# Altium schematic sheet Almazny_top.SchDoc: Almazny
size 420 x 297 mm; Author: many authors; CompanyName: WUT; DrawnBy: S. Hanasz; Organization: WUT ISE; Address1: Warsaw Univeristy of Technology; Address2: Nowowiejska 15/19; SheetNumber: 1; SheetTotal: 4; EDA_Number: ARTIQ; Projet: ARTIQ/SINARA; ModifiedBy: -; CreateDate: 15.10.2020; CheckedDate: -; Title2: Top Schematic; DivGrp: ISE; Designer: S.Hanasz; ModifiedDate: -; ProjectName: ARTIQ/SINARA
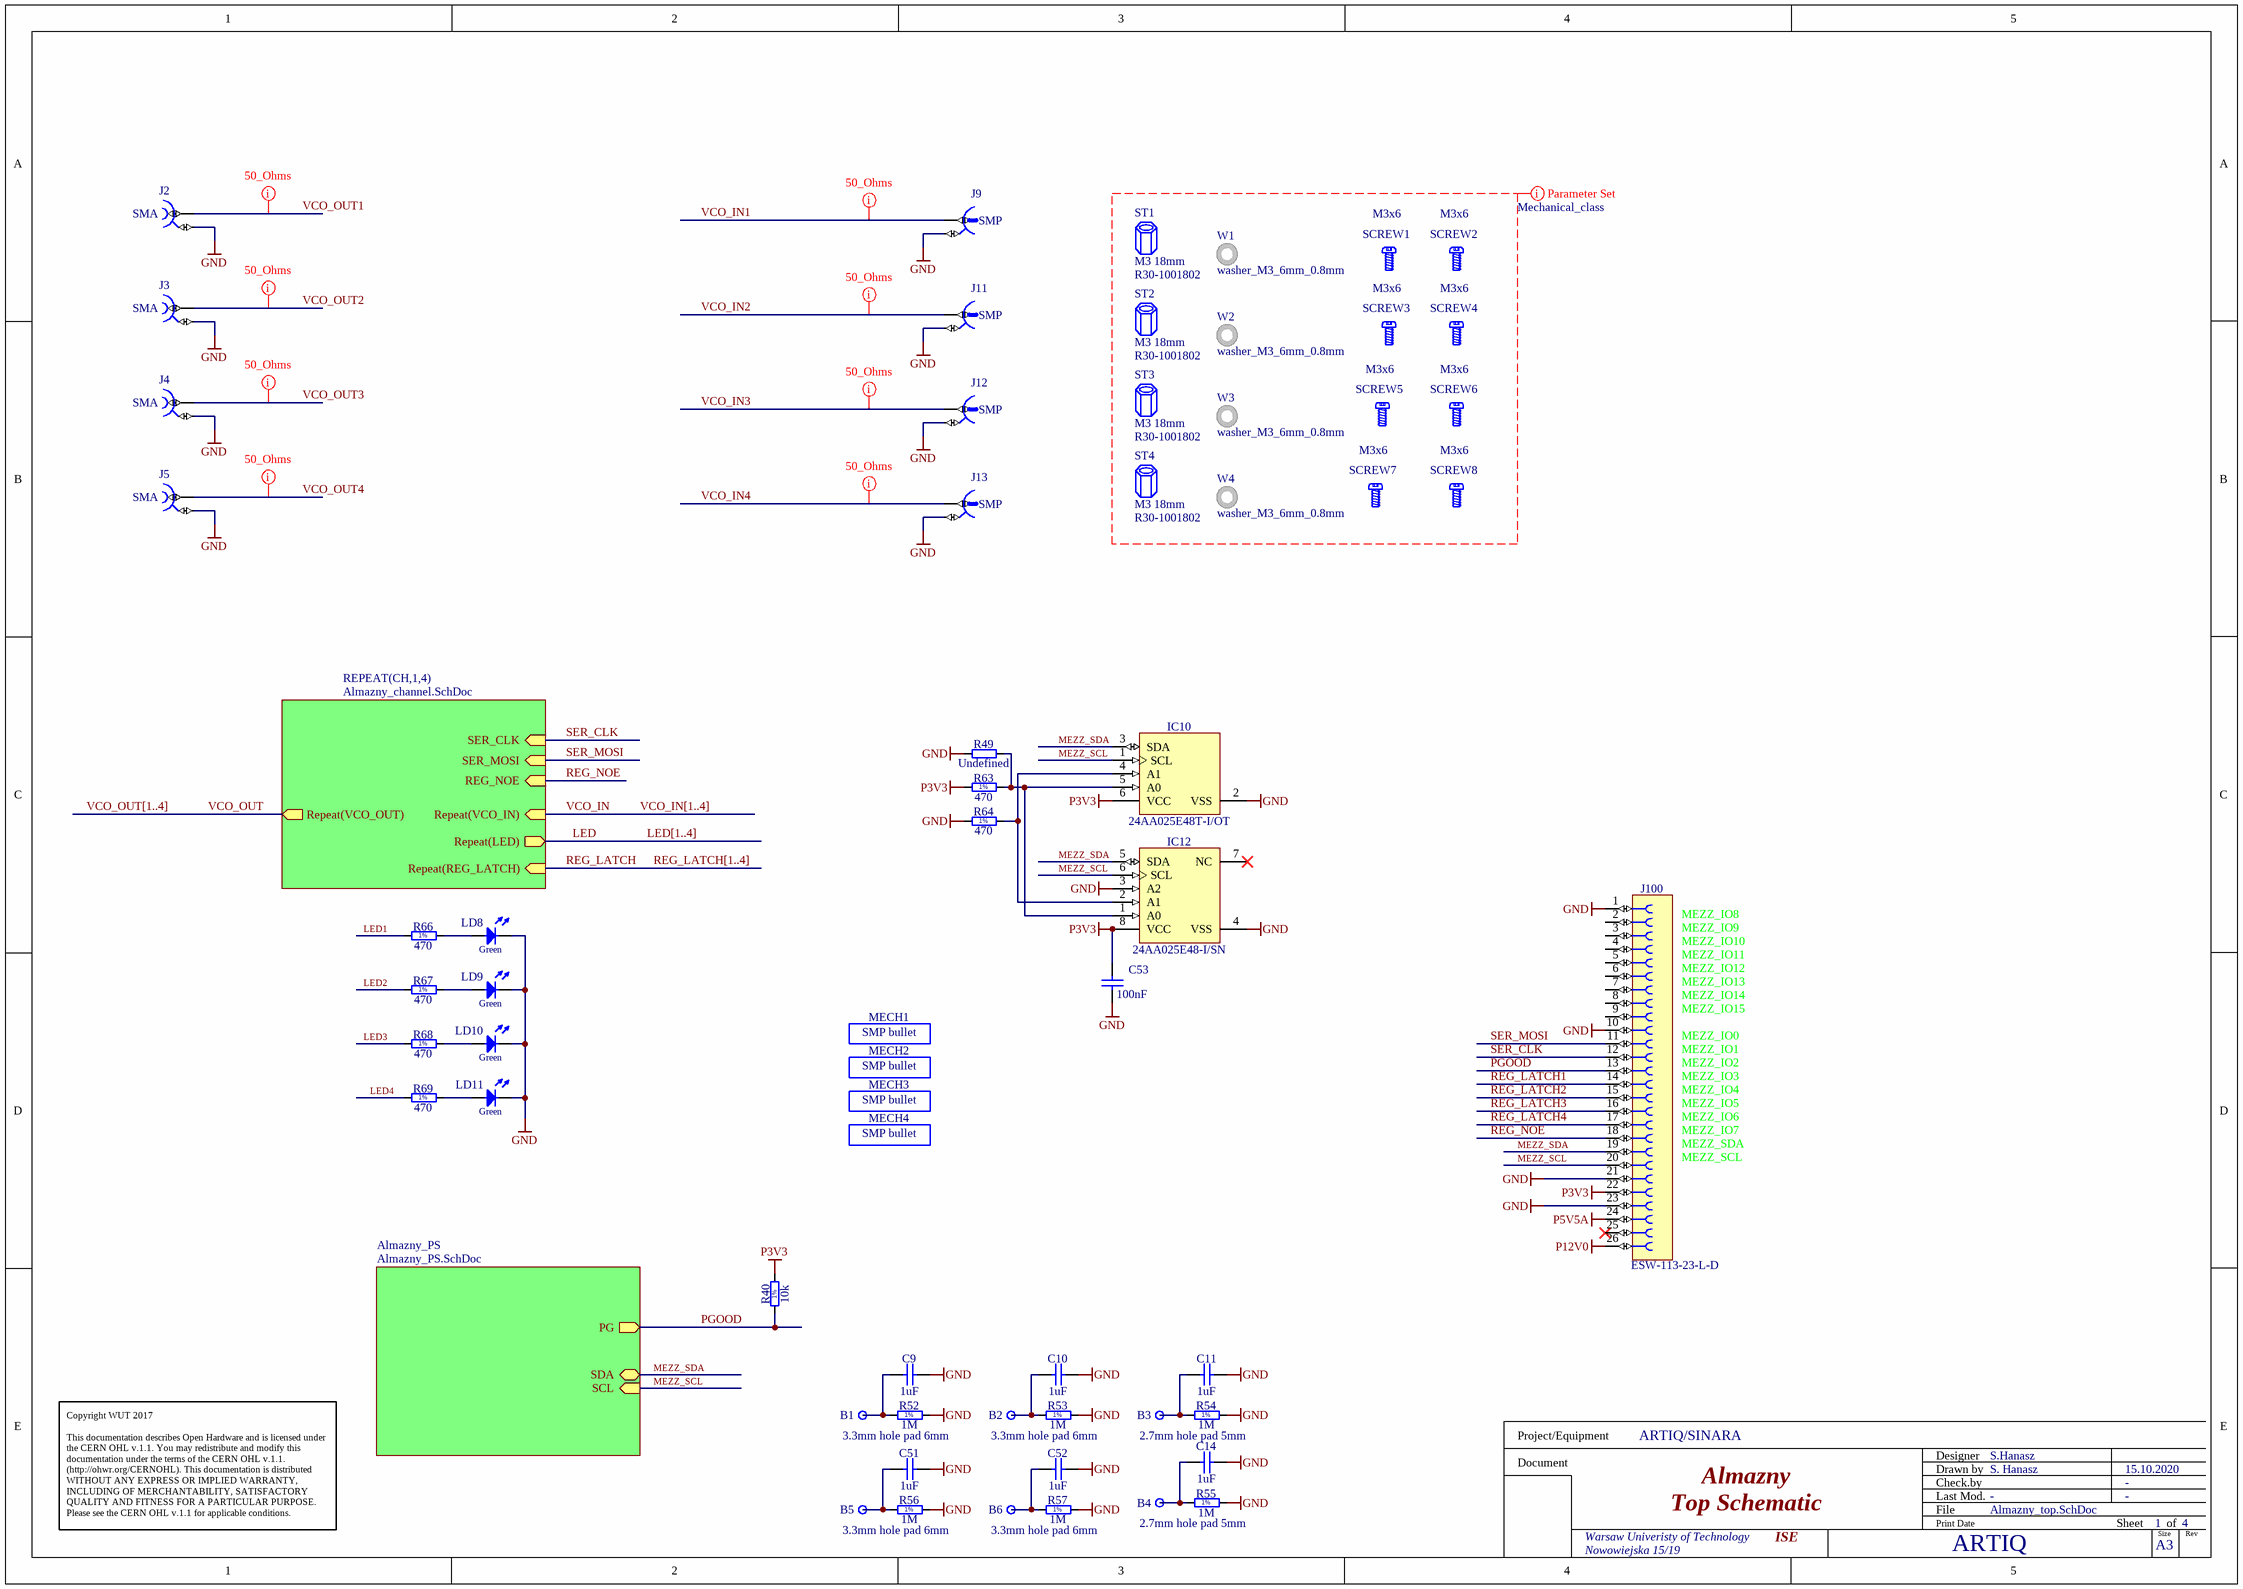
[diagram p0: Almazny_top.SchDoc]

## Parts
B1  3.3mm hole pad 6mm  [MTG330_600]
B2  3.3mm hole pad 6mm  [MTG330_600]
B3  2.7mm hole pad 5mm  [MTG270_500]
B4  2.7mm hole pad 5mm  [MTG270_500]
B5  3.3mm hole pad 6mm  [MTG330_600]
B6  3.3mm hole pad 6mm  [MTG330_600]
C9  1uF  [CAPC3216X140N]
C10  1uF  [CAPC3216X140N]
C11  1uF  [CAPC3216X140N]
C14  1uF  [CAPC3216X140N]
C51  1uF  [CAPC3216X140N]
C52  1uF  [CAPC3216X140N]
C53  100nF  [CAPC1005X55N]
IC10  24AA025E48T-I/OT  [SOT95P280X145-6N]
IC12  24AA025E48-I/SN  [SOIC127P600X175-8N]
J2  SMA  [TELEGARTNER_J01151A0451]
J3  SMA  [TELEGARTNER_J01151A0451]
J4  SMA  [TELEGARTNER_J01151A0451]
J5  SMA  [TELEGARTNER_J01151A0451]
J9  SMP  [MOLEX_85305-0232]
J11  SMP  [MOLEX_85305-0232]
J12  SMP  [MOLEX_85305-0232]
J13  SMP  [MOLEX_85305-0232]
J100  ESW-113-23-L-D  [ESW-113-23-L-D]
LD8  Green  [LED_DIALIGHT_555-230]
LD9  Green  [LED_DIALIGHT_555-230]
LD10  Green  [LED_DIALIGHT_555-230]
LD11  Green  [LED_DIALIGHT_555-230]
MECH1  SMP bullet  [GENERIC_MECH]
MECH2  SMP bullet  [GENERIC_MECH]
MECH3  SMP bullet  [GENERIC_MECH]
MECH4  SMP bullet  [GENERIC_MECH]
R40  10k  [RESC1005X40N]
R49  Undefined  [RESC1005X40N]
R52  1M  [RESC1608X55N]
R53  1M  [RESC1608X55N]
R54  1M  [RESC1608X55N]
R55  1M  [RESC1608X55N]
R56  1M  [RESC1608X55N]
R57  1M  [RESC1608X55N]
R63  470  [RESC1005X40N]
R64  470  [RESC1005X40N]
R66  470  [RESC1005X40N]
R67  470  [RESC1005X40N]
R68  470  [RESC1005X40N]
R69  470  [RESC1005X40N]
SCREW1  M3x6  [BOSSARD_BN9524-3271397_v]
SCREW2  M3x6  [BOSSARD_BN9524-3271397_v]
SCREW3  M3x6  [BOSSARD_BN9524-3271397_v]
SCREW4  M3x6  [BOSSARD_BN9524-3271397_v]
SCREW5  M3x6  [BOSSARD_BN9524-3271397_v]
SCREW6  M3x6  [BOSSARD_BN9524-3271397_v]
SCREW7  M3x6  [BOSSARD_BN9524-3271397_v]
SCREW8  M3x6  [BOSSARD_BN9524-3271397_v]
ST1  M3 18mm  [R30-1001802]
ST2  M3 18mm  [R30-1001802]
ST3  M3 18mm  [R30-1001802]
ST4  M3 18mm  [R30-1001802]
W1  washer_M3_6mm_0.8mm  [washer_M3_6mm_0.8mm]
W2  washer_M3_6mm_0.8mm  [washer_M3_6mm_0.8mm]
W3  washer_M3_6mm_0.8mm  [washer_M3_6mm_0.8mm]
W4  washer_M3_6mm_0.8mm  [washer_M3_6mm_0.8mm]

## Sub-sheets
Almazny_PS = Almazny_PS.SchDoc: PG (out), SDA (bidir), SCL (in)
REPEAT(CH,1,4) = Almazny_channel.SchDoc: SER_CLK (in), SER_MOSI (in), REG_NOE (in), Repeat(VCO_OUT) (out), Repeat(VCO_IN) (in), Repeat(REG_LATCH) (in), Repeat(LED) (out)

## Nets
GND: C9.2 C10.2 C11.2 C14.2 C51.2 C52.2 C53.1 IC10.2(VSS) IC12.3(A2) IC12.4(VSS) J2.2 J3.2 J4.2 J5.2 J9.2 J11.2 J12.2 J13.2 J100.1 J100.10 J100.21 J100.23 LD8.1(C) LD9.1(C) LD10.1(C) LD11.1(C) R49.1 R52.2 R53.2 R54.2 R55.2 R56.2 R57.2 R64.1
P3V3: C53.2 IC10.6(VCC) IC12.8(VCC) J100.22 R40.2 R63.1
P5V5A: J100.24
P12V0: J100.26
LED: sheet REPEAT(CH,1,4)/Repeat(LED)
LED1: R66.1
LED2: R67.1
LED3: R68.1
LED4: R69.1
MEZZ_SCL: IC10.1(SCL) IC12.6(SCL) J100.20 ; sheet Almazny_PS/SCL
MEZZ_SDA: IC10.3(SDA) IC12.5(SDA) J100.19 ; sheet Almazny_PS/SDA
PGOOD: J100.13 R40.1 ; sheet Almazny_PS/PG
REG_LATCH: sheet REPEAT(CH,1,4)/Repeat(REG_LATCH)
REG_LATCH1: J100.14
REG_LATCH2: J100.15
REG_LATCH3: J100.16
REG_LATCH4: J100.17
REG_NOE: J100.18 ; sheet REPEAT(CH,1,4)/REG_NOE
SER_CLK: J100.12 ; sheet REPEAT(CH,1,4)/SER_CLK
SER_MOSI: J100.11 ; sheet REPEAT(CH,1,4)/SER_MOSI
VCO_IN: sheet REPEAT(CH,1,4)/Repeat(VCO_IN)
VCO_IN1: J9.1
VCO_IN2: J11.1
VCO_IN3: J12.1
VCO_IN4: J13.1
VCO_OUT: sheet REPEAT(CH,1,4)/Repeat(VCO_OUT)
VCO_OUT1: J2.1
VCO_OUT2: J3.1
VCO_OUT3: J4.1
VCO_OUT4: J5.1
NetB1_1: B1.1 C9.1 R52.1
NetB2_1: B2.1 C10.1 R53.1
NetB3_1: B3.1 C11.1 R54.1
NetB4_1: B4.1 C14.1 R55.1
NetB5_1: B5.1 C51.1 R56.1
NetB6_1: B6.1 C52.1 R57.1
NetIC10_4: IC10.4(A1) IC12.2(A1) R64.2
NetIC10_5: IC10.5(A0) IC12.1(A0) R49.2 R63.2
NetLD8_2: LD8.2(A) R66.2
NetLD9_2: LD9.2(A) R67.2
NetLD10_2: LD10.2(A) R68.2
NetLD11_2: LD11.2(A) R69.2

Not connected (* = marked no-connect by the designer): IC12 7(NC)*; J100 2 3 4 5 6 7 8 9 25*

## Buses and harness runs
bus LED[1..4]
bus REG_LATCH[1..4]
bus VCO_IN[1..4]
bus VCO_OUT[1..4]

## Layout directives
net class 50_Ohms: VCO_IN1, VCO_IN2, VCO_IN3, VCO_IN4, VCO_OUT1, VCO_OUT2, VCO_OUT3, VCO_OUT4
CompClassName: Mechanical_class: (no net found under the mark)

## Notes on the sheet
- (near J100) MEZZ_IO8
- (near J100) MEZZ_IO9
- (near J100) MEZZ_IO10
- (near J100) MEZZ_IO11
- (near J100) MEZZ_IO12
- (near J100) MEZZ_IO13
- (near J100) MEZZ_IO14
- (near J100) MEZZ_IO15
- (near J100) MEZZ_IO0
- (near J100) MEZZ_IO1
- (near J100) MEZZ_IO2
- (near J100) MEZZ_IO3
- (near J100) MEZZ_IO4
- (near J100) MEZZ_IO5
- (near J100) MEZZ_IO6
- (near J100) MEZZ_IO7
- (near J100) MEZZ_SDA
- (near J100) MEZZ_SCL
- Copyright WUT 2017
  This documentation describes Open Hardware and is licensed under the CERN OHL v.1.1. You may redistribute and modify this documentation under the terms of the CERN OHL v.1.1. (http://ohwr.org/CERNOHL). This documentation is distributed WITHOUT ANY EXPRESS OR IMPLIED WARRANTY, INCLUDING OF MERCHANTABILITY, SATISFACTORY QUALITY AND FITNESS FOR A PARTICULAR PURPOSE. Please see the CERN OHL v.1.1 for applicable conditions.
- Project/Equipment
- Document
- Designer
- Drawn by
- Check.by
- File
- Last Mod.
- Print Date
- Sheet
- Size
- A3
- of
- Rev
- (in symbol R0402_10K_1%_0.0625W_100PPM) 1%
- (in symbol R0402_470R_1%_0.0625W_100PPM) 1%
- (in symbol R0603_1M_1%_0.1W_100PPM) 1%

## Library data of the parts
B1 B2 B5 B6 = Hole_3_3mm: Part Number: PLATED_HOLE3.3_PAD560; Part Description: Plated Through Hole: Hole Dia.=2.7mm Pad Dia.=5.0mm; Mounted: No; Component Kind: Standard (No BOM); Component Type: Standard (No BOM); Pin Count: 1; Family: Plated Hole; Socket: No; SMD: No; Sense: No; Status: None; ComponentHeight: 0mm; HelpURL: Undefined; Author: CERN DEM JMW; CreateDate: 27/09/2011; LatestRevisionDate: 27/09/2011; PackageDescription: Plated Through Hole: Hole Dia.=2.7mm Pad Dia.=5.0mm
B3 B4 = Hole_2_7mm: Part Number: PLATED_HOLE2.7_PAD5.0; Part Description: Plated Through Hole: Hole Dia.=2.7mm Pad Dia.=5.0mm; Mounted: No; Component Kind: Standard (No BOM); Component Type: Standard (No BOM); Pin Count: 1; Family: Plated Hole; Socket: No; SMD: No; Sense: No; Status: None; ComponentHeight: 0mm; HelpURL: Undefined; Author: CERN DEM JMW; CreateDate: 27/09/2011; LatestRevisionDate: 27/09/2011; PackageDescription: Plated Through Hole: Hole Dia.=2.7mm Pad Dia.=5.0mm
C9-C11 C14 C51 C52 = CC1206_1UF_50V_10%_X7R: Non-polarised capacitor; Part Description: SMD Multilayer Chip Ceramic Capacitor; Manufacturer: GENERIC; Manufacturer1 Part Number: C1206F105K5RACTU; Voltage: 50V; TC: X7R; Tolerance: ±10%; Part Number: CC1206_1UF_50V_10%_X7R; Component Kind: Standard; Component Type: Standard; Pin Count: 2; Value: 1uF; Status: Preferred; Manufacturer Part Number: CC1206_1UF_50V_10%_X7R; Case: 1206; Mounted: Yes; Socket: No; SMD: Yes; Sense: No; Manufacturer1 Example: KEMET; Manufacturer1 ComponentHeight: 1.8mm; HelpURL: \\cern.ch\dfs\Applications\Altium\Datasheets\CC1206_X7R_KEMET_OPENMODE.pdf; Author: CERN DEM JLC; CreateDate: 07.11.2012; LatestRevisionDate: 07.11.2012
C53 = CC0402_100NF_16V_10%_X5R: Non-polarised capacitor; Part Description: SMD Multilayer Chip Ceramic Capacitor; Manufacturer: GENERIC; Manufacturer1 Part Number: GRM155R61C104KA88D; Voltage: 16V; TC: X5R; Tolerance: ±10%; Part Number: CC0402_100NF_16V_10%_X5R; Component Kind: Standard; Component Type: Standard; Pin Count: 2; Value: 100nF; Status: None; Manufacturer Part Number: CC0402_100NF_16V_10%_X5R; Case: 0402; Mounted: Yes; Socket: No; SMD: Yes; Sense: No; Manufacturer1 Example: MURATA; Manufacturer1 ComponentHeight: 0.55mm; HelpURL: \\cern.ch\dfs\Applications\Altium\Datasheets\CC0402_X5R_MURATA_GRM.pdf; Author: CERN DEM JLC; CreateDate: 10.12.2013; LatestRevisionDate: 10.12.2013
IC10 = 24AA025E48T-I/OT: 1.7V-5.5V, 2K I2C Serial EEPROM With EUI-48 Node Identity; Part Description: 1.7V-5.5V, 2K I2C Serial EEPROM with EUI-48™ Node Identity; Cascadable; Manufacturer: MICROCHIP TECHNOLOGY; PressFit: No; Bonding: No; Part Number: 24AA025E48T-I/OT; Component Kind: Standard; Component Type: Standard; Device: 24AA025E48T-I/OT; PackageDescription: SOT, 0.95mm pitch; 6 pin, 1.60mm W X 2.90mm L X 1.45mm H body, IPC Medium Density; Manufacturer Part Number: 24AA025E48T-I/OT; Pin Count: 6; Case: SOT23-6; Mounted: Yes; Socket: No; SMD: Yes; Sense: No; ComponentHeight: 1.45mm; HelpURL: \\cern.ch\dfs\Applications\Altium\Datasheets\24AA025E48T-I-OT.pdf; Author: CERN DEM BC; CreateDate: 06.12.2019; LatestRevisionDate: 06.12.2019
IC12 = 24AA025E48-I/SN: 1.7V-5.5V, 2K I2C™ Serial EEPROMs with EUI-48™ Node Identity; Manufacturer: MICROCHIP TECHNOLOGY; PressFit: No; Bonding: No; Part Number: 24AA025E48-I/SN; Component Kind: Standard; Component Type: Standard; Device: 24AA025E48-I/SN; PackageDescription: SOIC, 1.27mm Pitch; 8 Pin - Body 4x5mm, IPC Medium Density; Part Description: 1.7V-5.5V, 2K I2C™ Serial EEPROMs with EUI-48™ Node Identity; Manufacturer Part Number: 24AA025E48-I/SN; Pin Count: 8; Case: SOIC8; Mounted: Yes; Socket: No; SMD: Yes; Sense: No; ComponentHeight: 1.75mm; HelpURL: \\cern.ch\dfs\Applications\Altium\Datasheets\24AA025E48-I-SN.pdf; Author: CERN DEM MR; CreateDate: 19.07.2016; LatestRevisionDate: 19.07.2016
J2-J5 = TELEGARTNER_J01151A0451: Part Description: SMA 50 ohms Edge Mount Bulkhead Jack Receptacle; PressFit: No; Part Number: TELEGARTNER_J01151A0451; Component Kind: Standard; Component Type: Standard; Pin Count: 2; Family: SMA; Mounted: Yes; Socket: No; SMD: No; Sense: No; Status: None; Manufacturer: TELEGARTNER; Manufacturer Part Number: J01151A0451; ComponentHeight: 7mm; HelpURL: \\cern.ch\dfs\Applications\Altium\Datasheets\TELEGARTNER_J01151A0451.pdf; Author: CERN DEM JLC; CreateDate: 27.10.2016; LatestRevisionDate: 27.10.2016
J9 J11-J13 = MOLEX_85305-0232: Part Description: 50 Ohms, SMP Surface Mount Plug, Limited Detent; Manufacturer: MOLEX; PressFit: No; Part Number: MOLEX_85305-0232; Component Kind: Standard; Component Type: Standard; Pin Count: 2; Family: SMP; Mounted: Yes; Socket: No; SMD: Yes; Sense: No; Status: None; Manufacturer Part Number: 85305-0232; ComponentHeight: 4.1mm; HelpURL: \\cern.ch\dfs\Applications\Altium\Datasheets\MOLEX_85305-0232.pdf; Author: CERN DEM JMW; CreateDate: 09.08.2016; LatestRevisionDate: 09.08.2016
J100 = ESW-113-23-L-D: Connector Elevated Socket 26 POS 2.54mm, 13.59mm height; Manufacturer: Samtec; Manufacturer Part Number: ESW-113-23-L-D
LD8-LD11 = LED_DIALIGHT_555-2301F: LED Green 1C 2A; Part Description: Single 2mm Green LED CBI® Circuit Board Indicator; PressFit: No; Bonding: No; Part Number: LED_DIALIGHT_555-2301F; Component Kind: Standard; Component Type: Standard; Color: Green; PackageDescription: Single 2mm Green LED, Body 5.08x2.54mm, Pin spacing 2.54mm; Manufacturer: DIALIGHT; Manufacturer Part Number: 555-2301F; Pin Count: 2; Mounted: Yes; Socket: No; SMD: No; Sense: No; ComponentHeight: 6.35mm; HelpURL: \\cern.ch\dfs\Applications\Altium\Datasheets\LED_DIALIGHT_555-2301F.pdf; Author: CERN DEM JMW; CreateDate: 22.09.2008; LatestRevisionDate: 17.03.2010
MECH1-MECH4 = Generic_mechanical: generic; Part Number: SMP-FS2A-1674; Manufacturer: AMPHENOL RF; PressFit: No; Component Kind: Accessories; Component Type: Standard; Footprint: generic_MECH; Pin Count: 0; PackageDescription: generic; Mounted: Yes; Socket: No; SMD: No; Sense: No; Status: None; Value: SMP bullet; Part Description: SMP bullet; Manufacturer Part Number: SMP-FS2A-1674; ComponentHeight: 19mm; Author: GK; CreateDate: 28.10.2019; LatestRevisionDate: 28.10.2019
R40 = R0402_10K_1%_0.0625W_100PPM: Resistor - 1%; Part Description: General Purpose Thick Film Chip Resistor; Manufacturer: GENERIC; Manufacturer1 Part Number: 232270671003L; TC: ±100ppm/°C; PressFit: No; Part Number: R0402_10K_1%_0.0625W_100PPM; Component Kind: Standard; Component Type: Standard; Pin Count: 2; Value: 10k; Status: Not Recommended; Power: 0.0625W; Tolerance: ±1%; Manufacturer Part Number: R0402_10K_1%_0.0625W_100PPM; Case: 0402; Mounted: Yes; Sense: No; Socket: No; SMD: Yes; Manufacturer1 Example: YAGEO PHYCOMP; Manufacturer1 ComponentHeight: 0.4mm; HelpURL: \\cern.ch\dfs\Applications\Altium\Datasheets\R0402_Phycomp_RC0402.pdf; Author: CERN DEM JLC; CreateDate: 03.12.2007; LatestRevisionDate: 17.10.2012
R49 = R0402_NO-VALUE: Resistor; Part Description: Reserved Footprint For a 0402 (1005) Chip Resistor; PressFit: No; Mounted: No; Part Number: R0402_NO-VALUE; Component Kind: Standard; Component Type: Standard; Pin Count: 2; Value: Undefined; Status: None; Manufacturer: Undefined; Manufacturer Part Number: R0402_NO-VALUE; Case: 0402; Sense: No; Socket: No; SMD: Yes; Manufacturer1 Example: Undefined; Manufacturer1 Part Number: Undefined; Manufacturer1 ComponentHeight: Undefined; HelpURL: Undefined; Author: CERN DEM JLC; CreateDate: 03.12.2007; LatestRevisionDate: 13.03.2008
R52-R57 = R0603_1M_1%_0.1W_100PPM: Resistor - 1%; Part Description: General Purpose Thick Film Chip Resistor; Manufacturer: GENERIC; Manufacturer1 Part Number: NRC06F1004TRF; Power: 0.1W; TC: ±100ppm/°C; PressFit: No; Part Number: R0603_1M_1%_0.1W_100PPM; Component Kind: Standard; Component Type: Standard; Pin Count: 2; Value: 1M; Status: Preferred; Tolerance: ±1%; Manufacturer Part Number: R0603_1M_1%_0.1W_100PPM; Case: 0603; Mounted: Yes; Sense: No; Socket: No; SMD: Yes; Manufacturer1 Example: NIC COMPONENT; Manufacturer1 ComponentHeight: 0.55mm; HelpURL: \\cern.ch\dfs\Applications\Altium\Datasheets\R0603_NIC_NRC.pdf; Author: CERN DEM JLC; CreateDate: 03.12.2007; LatestRevisionDate: 13.03.2008
R63 R64 R66-R69 = R0402_470R_1%_0.0625W_100PPM: Resistor - 1%; Part Description: General Purpose Thick Film Chip Resistor; Manufacturer: GENERIC; Manufacturer1 Part Number: 232270674701L; TC: ±100ppm/°C; PressFit: No; Part Number: R0402_470R_1%_0.0625W_100PPM; Component Kind: Standard; Component Type: Standard; Pin Count: 2; Value: 470; Status: Not Recommended; Power: 0.0625W; Tolerance: ±1%; Manufacturer Part Number: R0402_470R_1%_0.0625W_100PPM; Case: 0402; Mounted: Yes; Sense: No; Socket: No; SMD: Yes; Manufacturer1 Example: YAGEO PHYCOMP; Manufacturer1 ComponentHeight: 0.4mm; HelpURL: \\cern.ch\dfs\Applications\Altium\Datasheets\R0402_Phycomp_RC0402.pdf; Author: CERN DEM JLC; CreateDate: 03.12.2007; LatestRevisionDate: 17.10.2012
SCREW1-SCREW8 = BOSSARD_BN9524-3271397_v: Screw; Part Description: M3 L=6mm Hexalobular Socket Flat Head Screw Fully Threaded with Special Low Head, ~08.8, Zinc Plated Blue; Manufacturer Part Number: BN9524 Art.3271397; PressFit: No; Part Number: BOSSARD_BN9524-3271397_v; Component Kind: Standard; Component Type: Mechanical; Pin Count: 0; PackageDescription: M3 L=6mm Hexalobular Socket Flat Head Screw Fully Threaded with Special Low Head, ~08.8, Zinc Plated Blue; Mounted: Yes; Socket: No; SMD: No; Sense: No; Status: None; Value: M3x6; Manufacturer: BOSSARD; ComponentHeight: 1.37mm; HelpURL: \\cern.ch\dfs\Applications\Altium\Datasheets\BOSSARD_BN9524-3271397.pdf; Author: CERN DEM JLC; CreateDate: 11.03.2019; LatestRevisionDate: 11.03.2019
ST1-ST4 = STANDOFF_HARWIN_R30_1001802: M3.0x18 standoff; Manufacturer: Harwin; Manufacturer Part Number: R30-1001802
W1-W4 = washer_M3_6mm_0.8mm: M3 Washer: / ID: 3.2mm / OD: 6mm / Thickness 0.8mm; Manufacturer: Accu Limited; Manufacturer Part Number: HAFZ-M3-A4